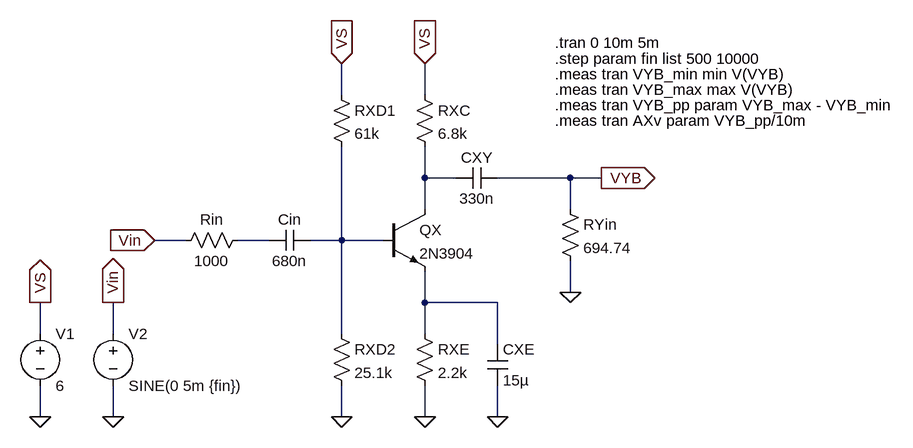
[diagram p0: schematic x.asc]
x.asc, the LTspice schematic file:
Version 4.1
SHEET 1 976 680
WIRE 96 -112 96 -160
WIRE 224 -112 224 -160
WIRE 224 16 224 -32
WIRE 272 16 224 16
WIRE 448 16 336 16
WIRE 496 16 448 16
WIRE 224 64 224 16
WIRE 448 64 448 16
WIRE -144 112 -192 112
WIRE -16 112 -64 112
WIRE 96 112 96 -32
WIRE 96 112 48 112
WIRE 160 112 96 112
WIRE 448 192 448 144
WIRE 224 208 224 160
WIRE 336 208 224 208
WIRE -368 256 -368 208
WIRE -256 256 -256 208
WIRE 96 256 96 112
WIRE 224 256 224 208
WIRE 336 272 336 208
WIRE -368 384 -368 336
WIRE -256 384 -256 336
WIRE 96 384 96 336
WIRE 224 384 224 336
WIRE 336 384 336 336
FLAG 224 384 0
FLAG 336 384 0
FLAG 496 16 VYB
IOPIN 496 16 Out
FLAG 96 384 0
FLAG -192 112 Vin
IOPIN -192 112 In
FLAG 96 -160 VS
IOPIN 96 -160 In
FLAG 224 -160 VS
IOPIN 224 -160 In
FLAG -256 384 0
FLAG -368 384 0
FLAG -368 208 VS
IOPIN -368 208 Out
FLAG -256 208 Vin
IOPIN -256 208 Out
FLAG 448 192 0
SYMBOL npn 160 64 R0
SYMATTR InstName QX
SYMATTR Value 2N3904
SYMBOL res 208 240 R0
SYMATTR InstName RXE
SYMATTR Value 2.2k
SYMBOL cap 320 272 R0
SYMATTR InstName CXE
SYMATTR Value 15µ
SYMBOL res 208 -128 R0
SYMATTR InstName RXC
SYMATTR Value 6.8k
SYMBOL res 80 -128 R0
SYMATTR InstName RXD1
SYMATTR Value 61k
SYMBOL res 80 240 R0
SYMATTR InstName RXD2
SYMATTR Value 25.1k
SYMBOL voltage -256 240 R0
WINDOW 123 0 0 Left 0
WINDOW 39 0 0 Left 0
SYMATTR InstName V2
SYMATTR Value SINE(0 5m {fin})
SYMBOL voltage -368 240 R0
SYMATTR InstName V1
SYMATTR Value 6
SYMBOL cap 48 96 R90
WINDOW 0 0 32 VBottom 2
WINDOW 3 32 32 VTop 2
SYMATTR InstName Cin
SYMATTR Value 680n
SYMBOL res 432 48 R0
SYMATTR InstName RYin
SYMATTR Value 694.74
SYMBOL cap 336 0 R90
WINDOW 0 0 32 VBottom 2
WINDOW 3 32 32 VTop 2
SYMATTR InstName CXY
SYMATTR Value 330n
SYMBOL res -48 96 R90
WINDOW 0 0 56 VBottom 2
WINDOW 3 32 56 VTop 2
SYMATTR InstName Rin
SYMATTR Value 1000
TEXT 424 -192 Left 2 !.tran 0 10m 5m
TEXT 424 -168 Left 2 !.step param fin list 500 10000
TEXT 424 -144 Left 2 !.meas tran VYB_min min V(VYB)
TEXT 424 -120 Left 2 !.meas tran VYB_max max V(VYB)
TEXT 424 -96 Left 2 !.meas tran VYB_pp param VYB_max - VYB_min
TEXT 424 -72 Left 2 !.meas tran AXv param VYB_pp/10m

The netlist it stands for:
* x.asc
QX N001 N003 N004 0 2N3904
RXE N004 0 2.2k
CXE N004 0 15µ
RXC VS N001 6.8k
RXD1 VS N003 61k
RXD2 N003 0 25.1k
V2 Vin 0 SINE(0 5m {fin})
V1 VS 0 6
Cin N003 N002 680n
RYin VYB 0 694.74
CXY VYB N001 330n
Rin N002 Vin 1000
.model NPN NPN
.model PNP PNP
.lib standard.bjt
.tran 0 10m 5m
.step param fin list 500 10000
.meas tran VYB_min min V(VYB)
.meas tran VYB_max max V(VYB)
.meas tran VYB_pp param VYB_max - VYB_min
.meas tran AXv param VYB_pp/10m
.backanno
.end